# Altium project Power15V0_0.3A_TrLess.PrjPcb
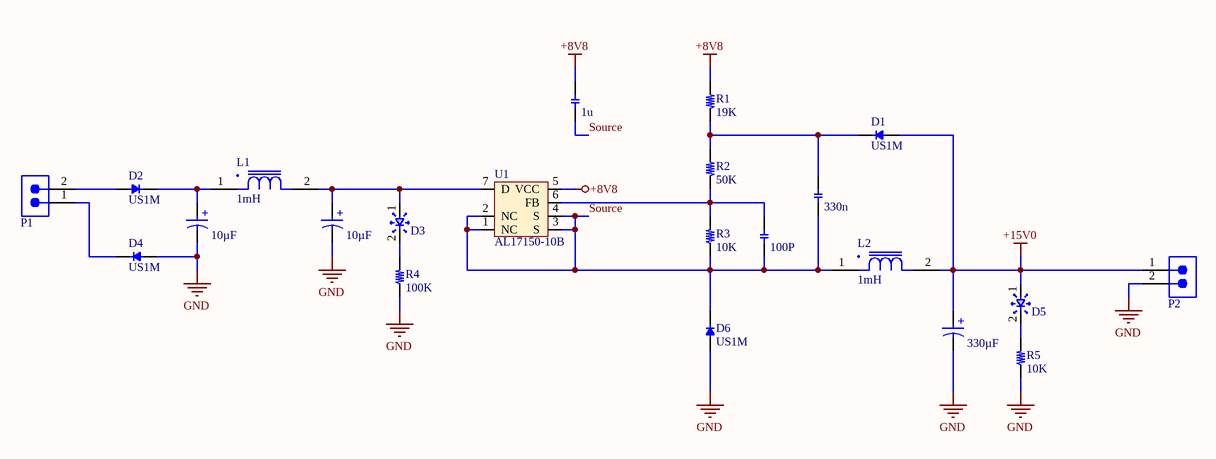
[diagram p0: AL17150.SchDoc]
1 sheet, 22 parts. Net scope: global (net labels, ports and power ports of the same name join across sheets).
Board file: Power15V0_0.3A_TrLess.PcbDoc

## Sheet AL17150.SchDoc: Power15V0_0.3A_TrLess
size 381 x 241 mm; Revision: 1; SheetNumber: 1; SheetTotal: 1; SPICEModelCacheJJBWWNRI: <root> / <DocumentId>JJBWWNRI</DocumentId> / <CacheFrame Number="0"> / <Model Name="860241478003_10uf" Kind="CKT"> / <Text>******* / .subckt 860241478003_10uF 1 2 / Rser 1 3 1.01763676485 / Lser 2 4 9.918160074E-09 / C1 3 4 0.00001 / Rpar 3 4 10000000 / .ends 860241478003_10uF</Text> / </Model> / <Model Name="860240578009_330uf" Kind="CKT"> / <Text>******* / .subckt 860240578009_330uF 1 2 / Rser 1 3 0.092 / Lser 2 4 0.000000007 / C1 3 4 0.00033 / Rpar 3 4 303030.303030303 / .ends 860240578009_330uF</Text> / </Model> / </CacheFrame> / </root>

### Parts
C1  1u  [C 1206]
C2  330n  [C 1206]
C3  10µF  [WCAP-AT1H_D13H20]
C4  10µF  [WCAP-AT1H_D13H20]
C5  100P  [C 1206]
C6  330µF  [WCAP-AT1H_D13H20]
D1  US1M  [DIOD_SMA]
D2  US1M  [DIOD_SMA]
D3  LED_SMD  [D 1206]  (value not drawn)
D4  US1M  [DIOD_SMA]
D5  LED_SMD  [D 1206]  (value not drawn)
D6  US1M  [DIOD_SMA]
L1  1mH  [L_5mm_DIP-2]
L2  1mH  [L_5mm_DIP-2]
P1  691322310002  [691322310002]  (value not drawn)
P2  691322310002  [691322310002]  (value not drawn)
R1  19K  [R 1206]
R2  50K  [R 1206]
R3  10K  [R 1206]
R4  100K  [R 1206]
R5  10K  [R 1206]
U1  AL17150-10B  [SOIC-7]

### Nets
+8V8: C1.2 R1.1 U1.5(VCC)
+15V0: C6.1(P) D1.1 D5.1 L2.2 P2.1
GND: C3.2(N) C4.2(N) C6.2(N) D4.1 D6.1 P2.2 R4.1 R5.1
Source: C1.1 C2.1 C5.1 D6.2 L2.1 R3.1 U1.1(NC) U1.2(NC) U1.3(S) U1.4(S)
NetC2_2: C2.2 D1.2 R1.2 R2.1
NetC3_1: C3.1(P) D2.2 L1.1
NetC4_1: C4.1(P) D3.1 L1.2 U1.7(D)
NetC5_2: C5.2 R2.2 R3.2 U1.6(FB)
NetD2_1: D2.1 P1.2
NetD3_2: D3.2 R4.2
NetD4_2: D4.2 P1.1
NetD5_2: D5.2 R5.2

### Notes on the sheet
- (in symbol 860240578009) +
- (in symbol 860241478003) +

### Library data of the parts
C1 C2 C5 = CAP_SMD
C3 C4 = 860241478003: WCAP-AT1H Aluminum Electrolytic Capacitor, Radial, THT, D13 x H20mm, 10µF, 450V; Manufacturer: Wurth Elektronik; Capacitance Tolerance: +/-20%; Dissipation Factor: 20%; Endurance: 10000h; Leakage Current: 280µA; Ripple Current: 390mA; Technical Reference: ATJI200100M450DSPACK000; Manufacturer Part Number: 860241478003; Category: Aluminum Electrolytic Capacitors; Match Code: WCAP-AT1H; ComponentLink1Description: Website Link; ComponentLink1URL: https://www.we-online.com/redexpert/article/860241478003?ad; ComponentLink2Description: Datasheet Link; ComponentLink2URL: https://www.we-online.com/redexpert/spec/860241478003?ad; Mount: Through Hole; Operating Temperature Max: 105°C; Operating Temperature Min: -25°C; Packaging: Ammo Pack; Height: 20mm; Diameter: 13mm; Capacitance: 10µF; Rated Voltage (DC): 450V
C6 = 860240578009: WCAP-AT1H Aluminum Electrolytic Capacitor, Radial, THT, D13 x H20mm, 330µF, 35V; Manufacturer: Wurth Elektronik; Capacitance Tolerance: +/-20%; Dissipation Factor: 12%; Endurance: 10000h; Leakage Current: 115.5µA; Ripple Current: 1035mA; Technical Reference: ATDI200331M035DSPACK000; Manufacturer Part Number: 860240578009; Category: Aluminum Electrolytic Capacitors; Match Code: WCAP-AT1H; ComponentLink1Description: Website Link; ComponentLink1URL: https://www.we-online.com/redexpert/article/860240578009?ad; ComponentLink2Description: Datasheet Link; ComponentLink2URL: https://www.we-online.com/redexpert/spec/860240578009?ad; Mount: Through Hole; Operating Temperature Max: 105°C; Operating Temperature Min: -40°C; Packaging: Ammo Pack; Height: 20mm; Diameter: 13mm; Capacitance: 330µF; Rated Voltage (DC): 35V
D1 D2 D4 D6 = DIOD_SMD
L1 L2 = Inductor
P1 P2 = 691322310002: WR-TBL Series 322 Horizontal PCB Header, Through Hole, pitch 3.81mm, 2p; Manufacturer: Wurth Elektronik; Pin Number: 2; Rated Current: 10A; Working Voltage: 300V; Modularity: No; ComponentLink1Description: Manufacturer Link; ComponentLink1URL: https://www.we-online.com/redexpert/article/691322310002?ad; ComponentLink2Description: Datasheet; ComponentLink2URL: https://www.we-online.com/redexpert/spec/691322310002?ad; Category: Terminal Blocks; Match Code: WR-TBL; Manufacturer Part Number: 691322310002; Mount: Through Hole; Operating Temperature Max: 105°C; Operating Temperature Min: -40°C; Packaging: Box; Pitch: 3.81mm; Orientation: Horizontal; Application: Pluggable; PCB/Cable/Panel: PCB
R1-R5 = RES_SMD